# EAGLE design ttgo-diy (EAGLE 7.6.0)
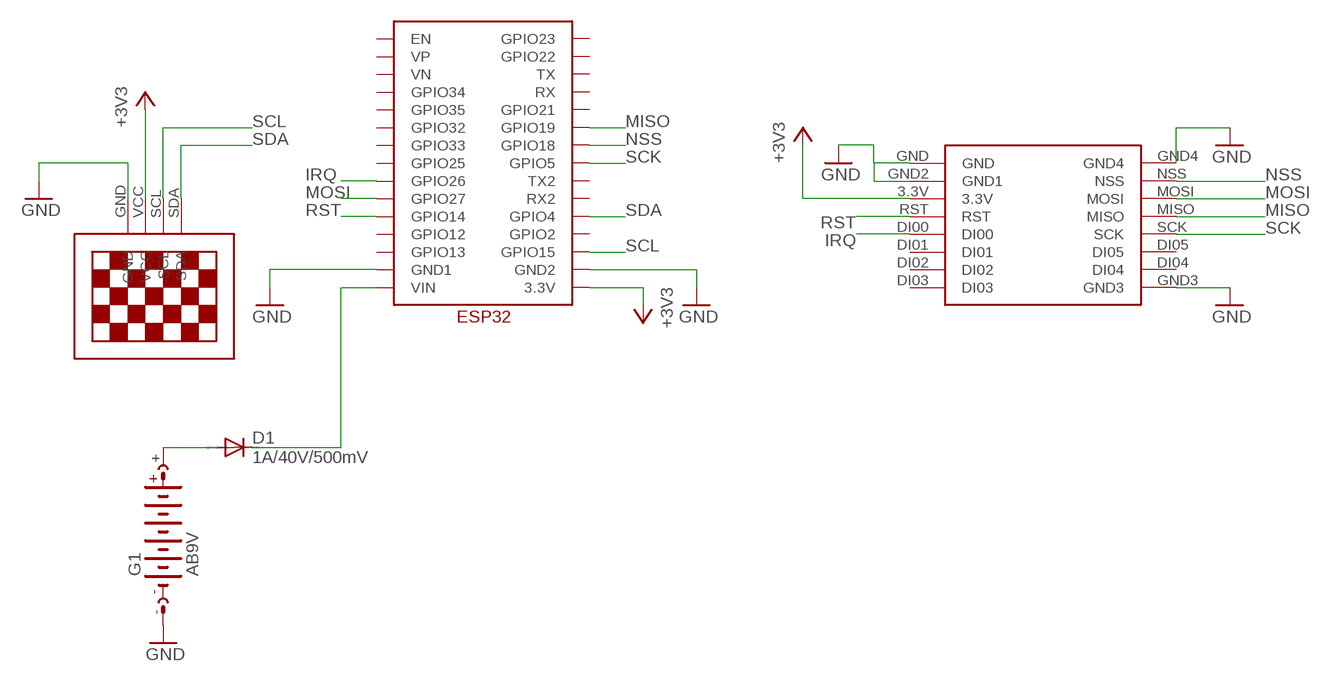
[diagram p0: schematic, sheet 1]

## Parts
D1  1A/40V/500mV  1N4148DO35-10  [DO35-10]
G1  AB9V  [AB9V]
U$1  LORA-02DIL  [DIL8X11]
U$2  ESP32  [ESP32]
U$3  13"OLED13"OLED  [1.3"OLED]

## Nets
+3V3: U$1.3.3V U$2.3.3V U$3.VCC
GND: G1.- U$1.GND U$1.GND2(GND1) U$1.GND3 U$1.GND4 U$2.GND1 U$2.GND2 U$3.GND
IRQ: U$1.DI00 U$2.GPIO26
MISO: U$1.MISO U$2.GPIO19
MOSI: U$1.MOSI U$2.GPIO27
N$1: D1.C U$2.VIN
N$3: D1.A G1.+
NSS: U$1.NSS U$2.GPIO18
RST: U$1.RST U$2.GPIO14
SCK: U$1.SCK U$2.GPIO5
SCL: U$2.GPIO15 U$3.SCL
SDA: U$2.GPIO4 U$3.SDA
Unconnected: U$1.DI01 U$1.DI02 U$1.DI03 U$1.DI04 U$1.DI05 U$2.EN U$2.GPIO2 U$2.GPIO12 U$2.GPIO13 U$2.GPIO21 U$2.GPIO22 U$2.GPIO23 U$2.GPIO25 U$2.GPIO32 U$2.GPIO33 U$2.GPIO34 U$2.GPIO35 U$2.RX U$2.RX2 U$2.TX U$2.TX2 U$2.VN U$2.VP

## Library data of the parts
D1 = diode:1N4148: DIODE high speed (Philips)
G1 = battery:AB9V: 9-V BATTERY CLIP
U$1 = LORA-02:LORA-02: MODULO LORA-02
U$2 = ESP32:ESP32
U$3 = Oled-13:13"OLED

## Board
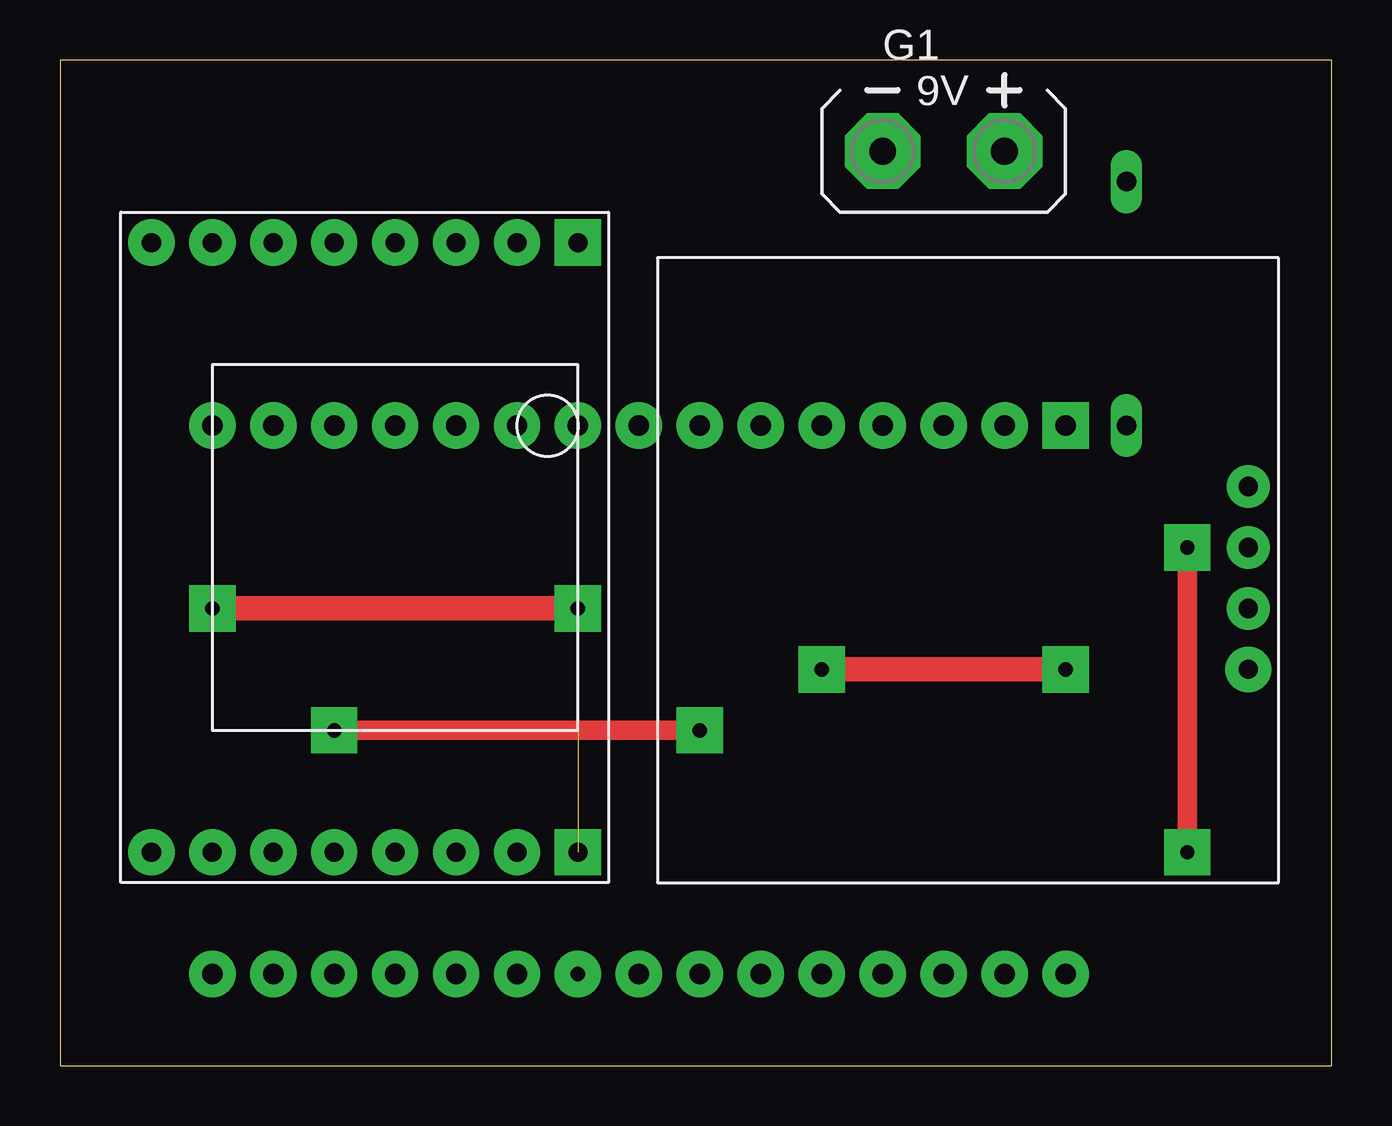
[diagram p1: board, top side]
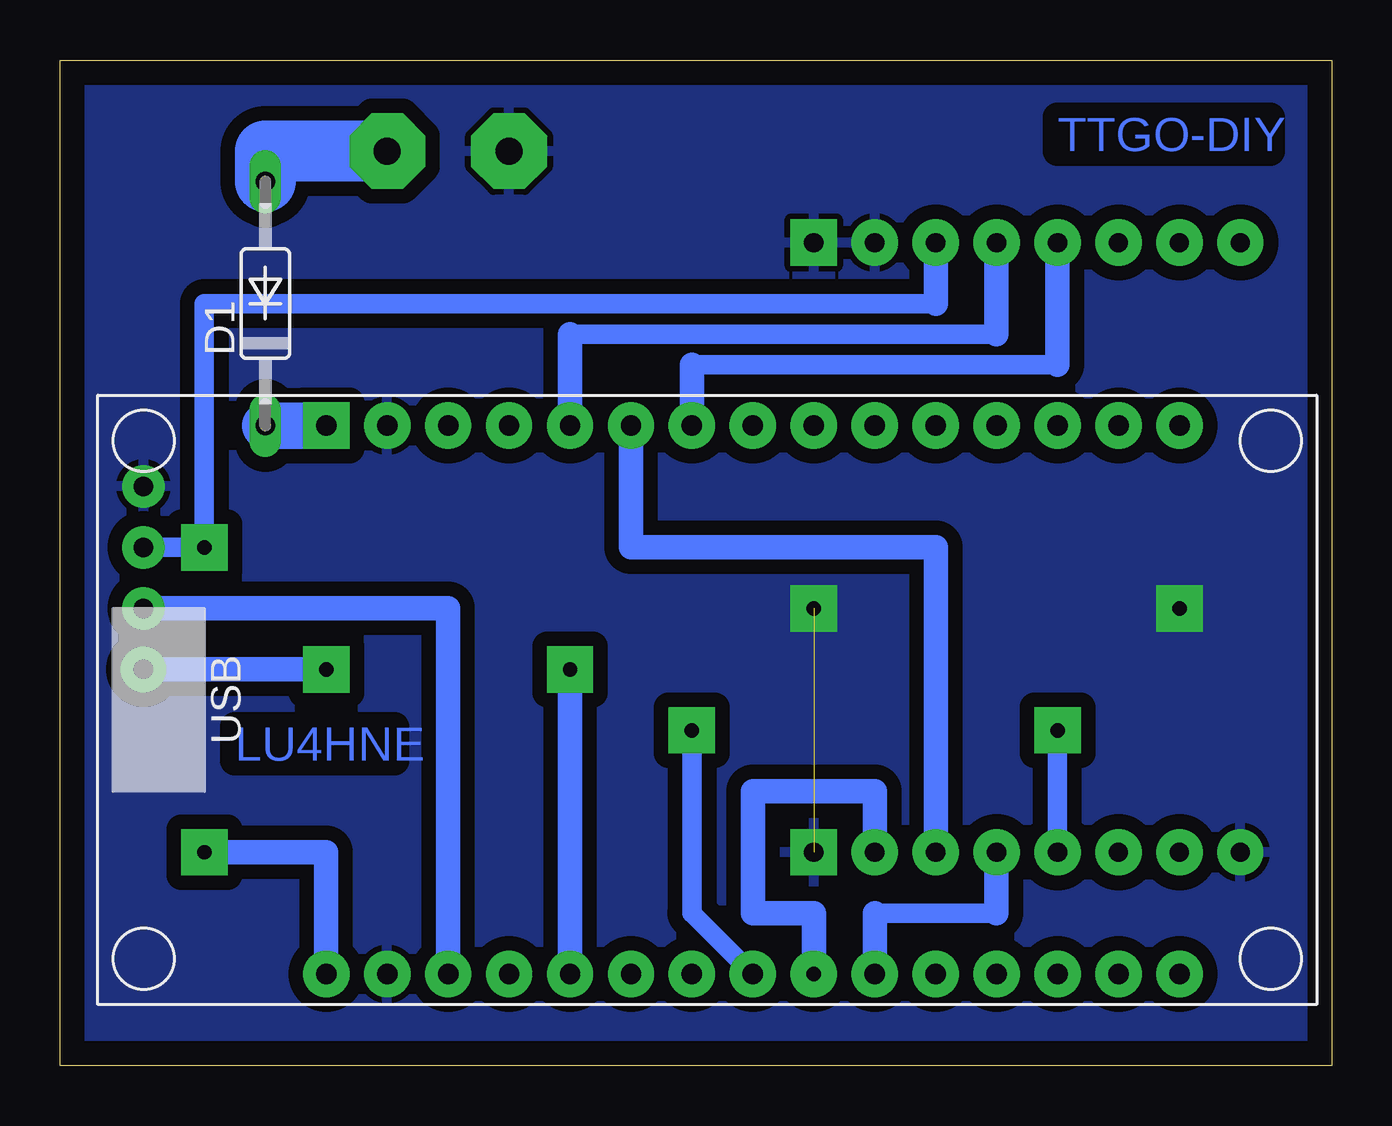
[diagram p2: board, bottom side, seen from below]

Size 53.01 x 41.9 mm. Coordinates in mm from the lower left corner, seen from the top.
Outline: 0,0 53.01,0 53.01,41.9 0,41.9 0,0
Copper layers (1*16): Top 0.035mm / dielectric 1.5mm / Bottom 0.035mm
Design rules "default": minimum track width 10mil, minimum drill 24mil, track to track 8mil, track to pad 8mil, pad to pad 8mil, via to via 8mil, smd to smd 8mil, copper to edge 40mil, drill to drill 8mil, minimum pad ring 10mil, minimum via ring 8mil, stop-mask expansion 4mil, vias tented up to drill 0mil, thermal gap 10mil

### Footprints (pad centres in the part's own frame; a part is rotated, then mirrored left to right if it is on the bottom)
DO35-10 = drill 0.813 long: A 5.08,0; C -5.08,0
AB9V = drill 1.118 pad 3.15 octagon: + 0,2.54; - 0,-2.54
DIL8X11 = drill 0.8 pad 1.93: 3.3V 0,-5.08; DI00 0,-10.16; DI01 0,-12.7; DI02 0,-15.24; DI03 0,-17.78; DI04 25.4,-15.24; DI05 25.4,-12.7; GND2 0,-2.54; GND3 25.4,-17.78; MISO 25.4,-7.62; MOSI 25.4,-5.08; NSS 25.4,-2.54; RST 0,-7.62; SCK 25.4,-10.16 | drill 0.8 pad 1.93 square: GND 0,0; GND4 25.4,0
ESP32 = drill 0.85 pad 1.93: 3.3V 22.86,0; EN 0,35.56; GND1 0,2.54; GND2 22.86,2.54; GPIO2 22.86,7.62; GPIO4 22.86,10.16; GPIO5 22.86,17.78; GPIO12 0,7.62; GPIO13 0,5.08; GPIO14 0,10.16; GPIO15 22.86,5.08; GPIO19 22.86,22.86; GPIO21 22.86,25.4; GPIO22 22.86,33.02; GPIO23 22.86,35.56; GPIO25 0,17.78; GPIO26 0,15.24; GPIO27 0,12.7; GPIO32 0,22.86; GPIO33 0,20.32; GPIO34 0,27.94; GPIO35 0,25.4; RX 22.86,27.94; RX2 22.86,12.7; TX 22.86,30.48; TX2 22.86,15.24; VN 0,30.48; VP 0,33.02 | drill 0.6 pad 1.93: GPIO18 22.86,20.32 | drill 0.85 pad 1.93 square: VIN 0,0
1.3"OLED = drill 0.8 pad 1.778: GND 0,0; SCL 5.08,0; VCC 2.54,0 | drill 0.8 pad 1.9: SDA 7.62,0

### Placement (x,y rotation side)
D1  44.45,31.75 90 bottom
G1  36.83,38.1 270 top
U$1  21.59,34.29 270 top
U$2  41.91,26.67 270 bottom
U$3  49.53,24.13 270 top

### Tracks (layer width: path | path; a pad name or v marks a point on that pad's centre or on a via)
+3V3  (via drill 0.6 pad 1.93)
  Top 0.813: v46.99,8.89 v46.99,21.59
  Bottom 0.813: 16.51,31.75 46.99,31.75 v46.99,21.59 U$3.VCC
  Bottom 1.016: U$1.3.3V 16.51,31.75 | U$2.3.3V 41.91,8.89 v46.99,8.89
GND  (via drill 0.6 pad 1.93)  (1 unrouted)
  Top 1.016: v6.35,19.05 v21.59,19.05
  pour Bottom (isolate 0.61): -3.81,46.99 54.61,46.99 54.61,-3.81 -3.81,-3.81
IRQ
  Bottom 0.813: 11.43,29.21 26.67,29.21
  Bottom 1.016: U$1.DI00 11.43,29.21 | 26.67,29.21 U$2.GPIO26
MISO
  Bottom 0.813: 13.97,6.35 19.05,6.35
  Bottom 1.016: U$1.MISO 13.97,6.35 | 19.05,6.35 U$2.GPIO19
MOSI
  Bottom 1.016: U$2.GPIO27 29.21,21.59 16.51,21.59 U$1.MOSI
N$1
  Bottom 1.93: U$2.VIN D1.C
N$3
  Bottom 2.54: G1.+ 44.45,38.1 D1.A
NSS
  Bottom 1.016: U$1.NSS 19.05,11.43 24.13,11.43 24.13,6.35 21.59,6.35 U$2.GPIO18
RST
  Bottom 0.813: 13.97,30.48 31.75,30.48
  Bottom 1.016: U$1.RST 13.97,30.48 | 31.75,30.48 U$2.GPIO14
SCK  (via drill 0.6 pad 1.93)
  Top 0.813: v11.43,13.97 v26.67,13.97
  Bottom 0.813: U$1.SCK v11.43,13.97 | v26.67,13.97 26.67,6.35 U$2.GPIO5
SCL
  Bottom 1.016: U$3.SCL 36.83,19.05 U$2.GPIO15
SDA  (via drill 0.6 pad 1.93)
  Top 1.016: v41.91,16.51 v31.75,16.51
  Bottom 1.016: U$3.SDA v41.91,16.51 | v31.75,16.51 U$2.GPIO4

### Text on the board
Bottom: TTGO-DIY | LU4HNE